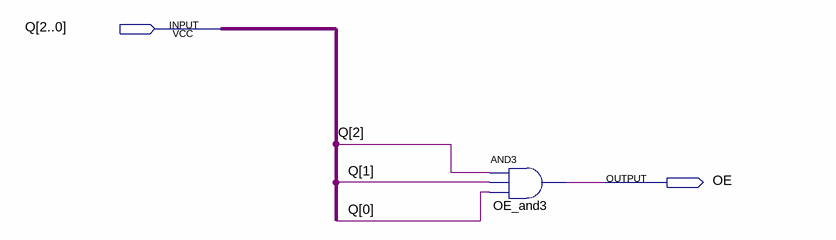
[diagram p0: schematic sheet]
// Quartus schematic OE.bdf as structural Verilog: 1 symbols, 2 pins
module OE (
  input  [2:0] Q,
  output OE
);

  and OE_and3 (OE, Q[2], Q[1], Q[0]);
endmodule
